# Altium project Relay Driver-10A-v1.0.PrjPcb (part 1 of 4)
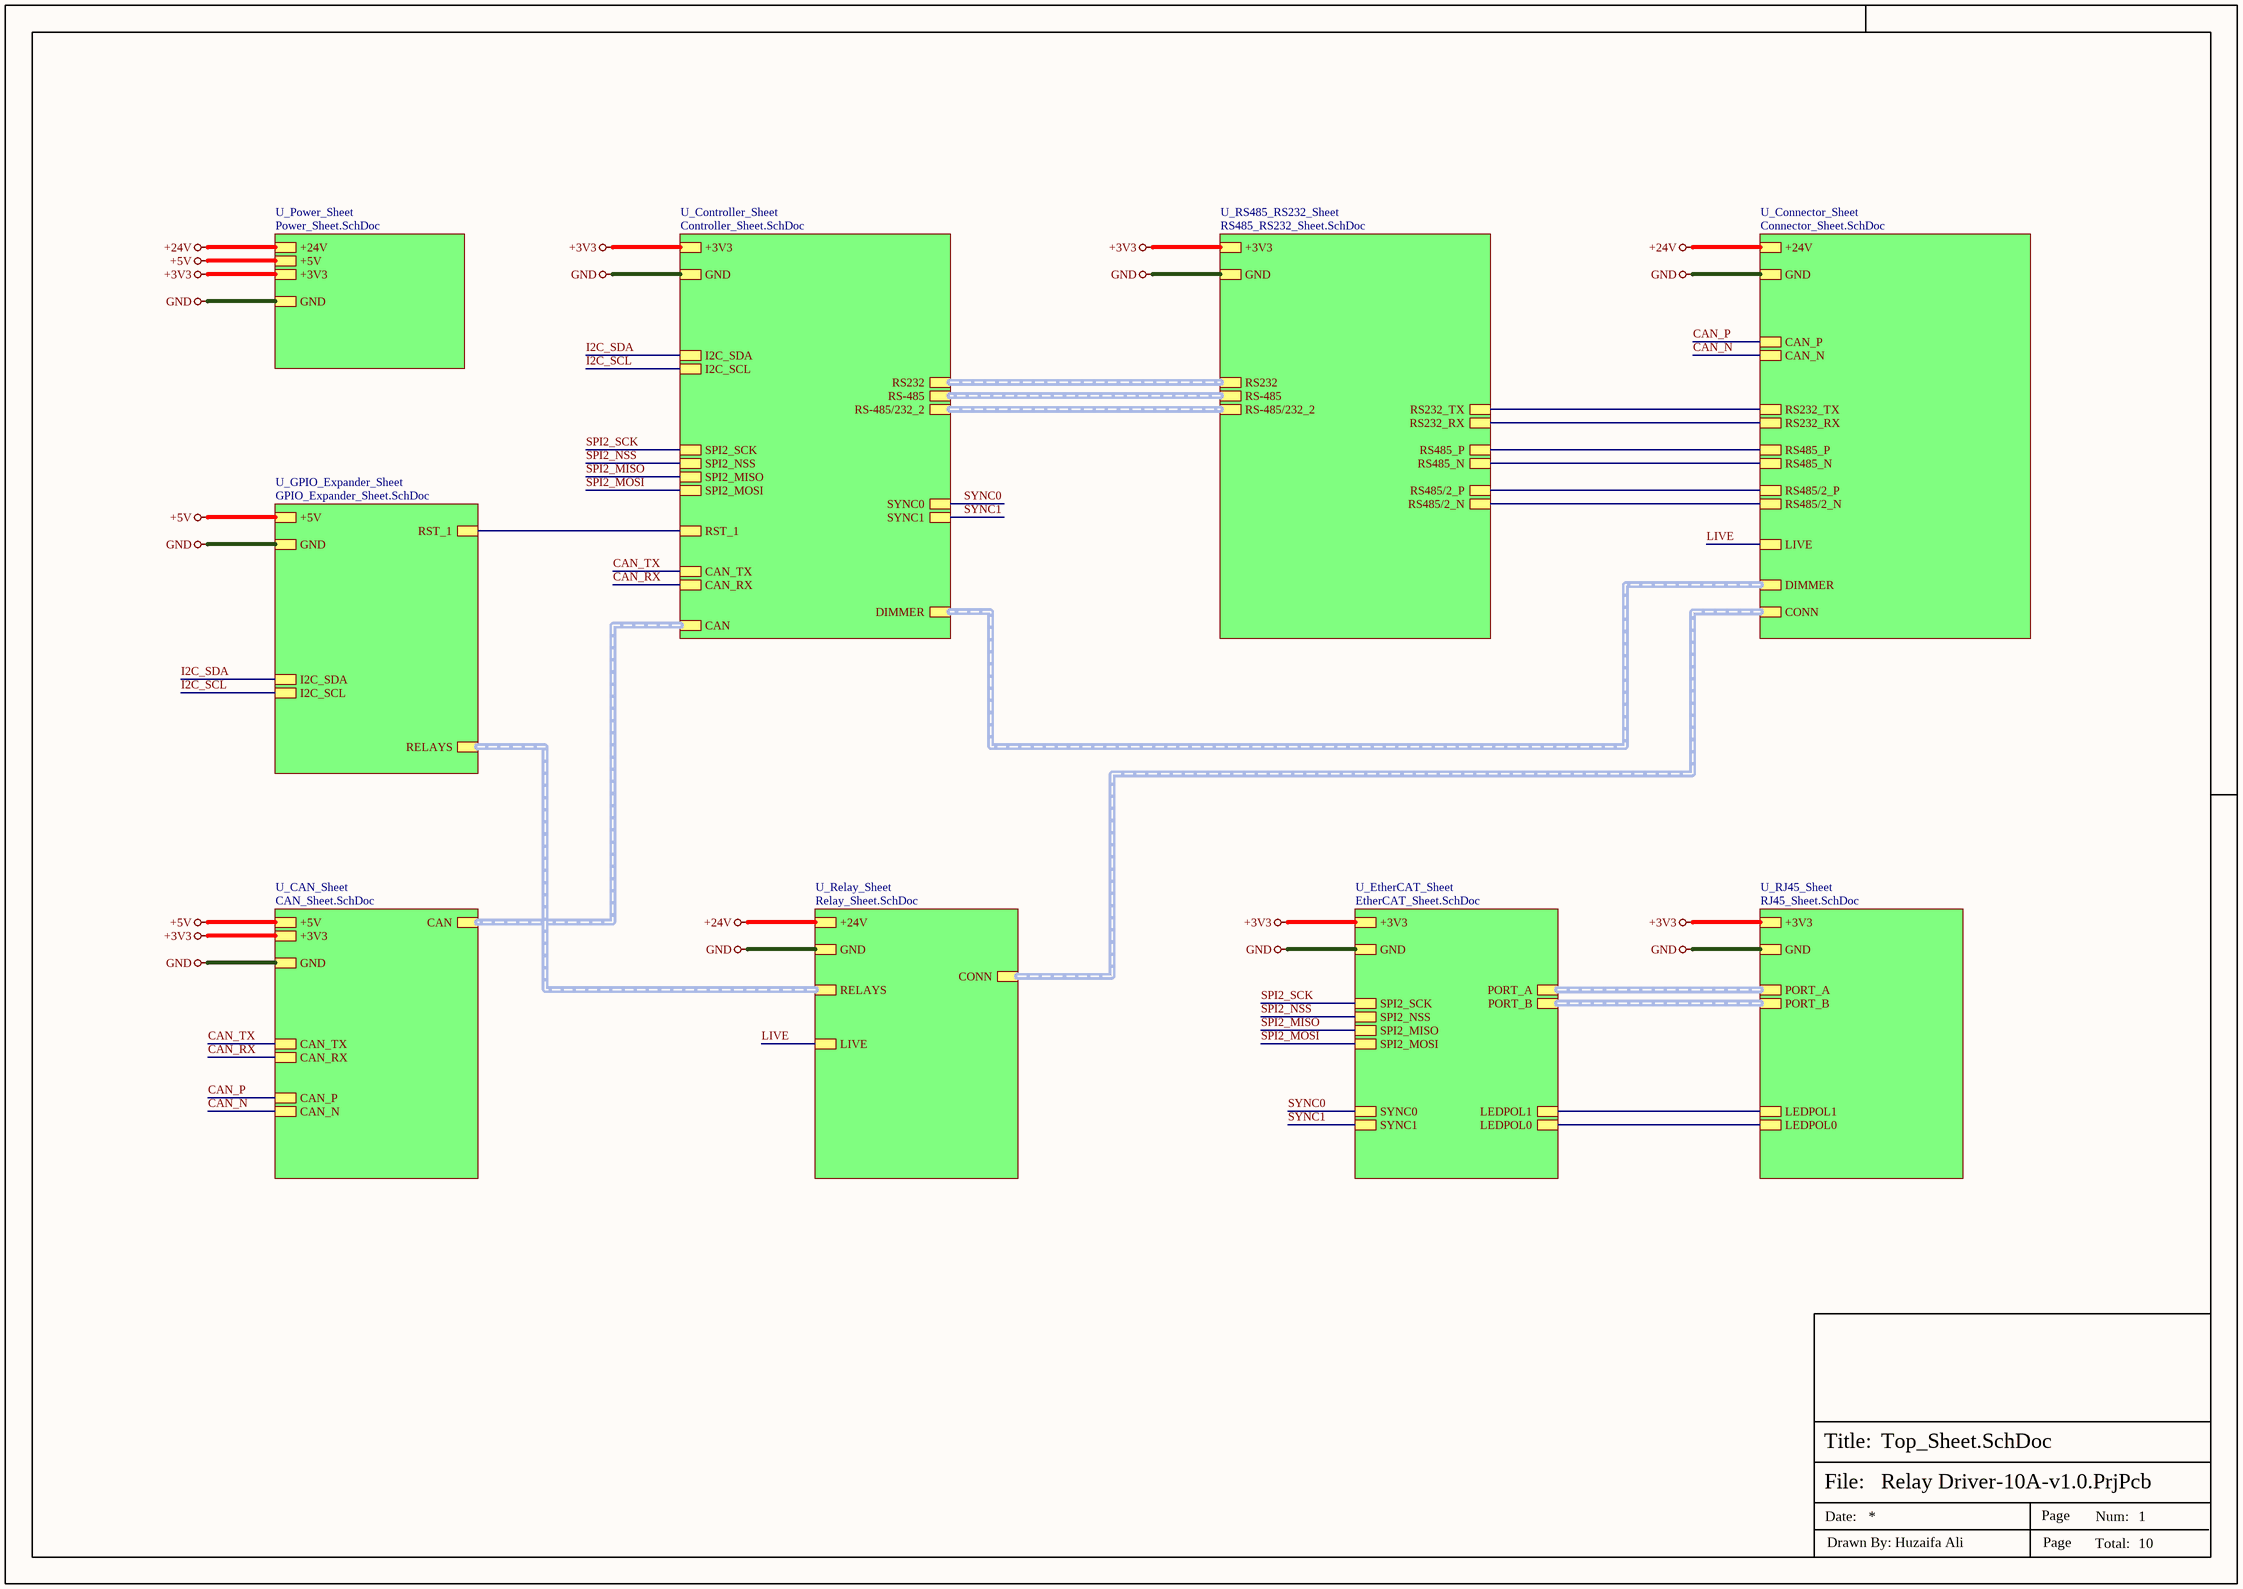
[diagram p0: Top_Sheet.SchDoc]
10 sheets, 284 parts. Net scope: hierarchical (ports join the sheet entries above them; power ports are global).
Board file: Relay-Driver10A.PcbDoc
Sheets:
  Top_Sheet.SchDoc
    U_CAN_Sheet = CAN_Sheet.SchDoc
    U_Connector_Sheet = Connector_Sheet.SchDoc
    U_Controller_Sheet = Controller_Sheet.SchDoc
    U_EtherCAT_Sheet = EtherCAT_Sheet.SchDoc
    U_Power_Sheet = Power_Sheet.SchDoc
    U_Relay_Sheet = Relay_Sheet.SchDoc
    U_RJ45_Sheet = RJ45_Sheet.SchDoc
    U_RS485_RS232_Sheet = RS485_RS232_Sheet.SchDoc
    U_GPIO_Expander_Sheet = GPIO_Expander_Sheet.SchDoc

## Sheet Top_Sheet.SchDoc
size 420 x 297 mm; SheetNumber: 1; SheetTotal: 10

### Sub-sheets
U_CAN_Sheet = CAN_Sheet.SchDoc: CAN (harness CAN), CAN_RX, CAN_TX, CAN_P, CAN_N, +5V, +3V3, GND
U_Connector_Sheet = Connector_Sheet.SchDoc: RS485/2_N, RS485/2_P, RS485_N, RS485_P, RS232_RX, RS232_TX, CAN_P, CAN_N, GND, +24V, CONN (harness CONN), LIVE, DIMMER (harness RELAYS)
U_Controller_Sheet = Controller_Sheet.SchDoc: SPI2_SCK, SPI2_NSS, SPI2_MISO, SPI2_MOSI, RS-485/232_2 (harness RS-485/232_2), RS232 (harness RS232), +3V3, GND, RS-485 (harness RS-485), CAN_RX, CAN_TX, CAN (harness CAN), SYNC0, SYNC1, RST_1, I2C_SDA, I2C_SCL, DIMMER (harness RELAYS)
U_EtherCAT_Sheet = EtherCAT_Sheet.SchDoc: PORT_A (harness PORT_A), PORT_B (harness PORT_B), LEDPOL0, LEDPOL1, SPI2_SCK, SPI2_NSS, SPI2_MISO, SPI2_MOSI, +3V3, GND, SYNC0, SYNC1
U_GPIO_Expander_Sheet = GPIO_Expander_Sheet.SchDoc: RST_1, RELAYS (harness RELAYS), +5V, GND, I2C_SDA, I2C_SCL
U_Power_Sheet = Power_Sheet.SchDoc: +5V, +3V3, GND, +24V
U_Relay_Sheet = Relay_Sheet.SchDoc: RELAYS (harness RELAYS), CONN (harness CONN), GND, +24V, LIVE
U_RJ45_Sheet = RJ45_Sheet.SchDoc: PORT_A (harness PORT_A), PORT_B (harness PORT_B), LEDPOL0, LEDPOL1, +3V3, GND
U_RS485_RS232_Sheet = RS485_RS232_Sheet.SchDoc: RS485_N, RS485_P, RS232_RX, RS232_TX, RS-485 (harness RS-485), +3V3, GND, RS485/2_N, RS485/2_P, RS-485/232_2 (harness RS-485/232_2), RS232 (harness RS232)

### Nets
+3V3: sheet U_CAN_Sheet/+3V3, sheet U_Controller_Sheet/+3V3, sheet U_EtherCAT_Sheet/+3V3, sheet U_Power_Sheet/+3V3, sheet U_RJ45_Sheet/+3V3, sheet U_RS485_RS232_Sheet/+3V3
+5V: sheet U_CAN_Sheet/+5V, sheet U_Power_Sheet/+5V, sheet U_GPIO_Expander_Sheet/+5V
+24V: sheet U_Connector_Sheet/+24V, sheet U_Power_Sheet/+24V, sheet U_Relay_Sheet/+24V
CAN_RX: sheet U_CAN_Sheet/CAN_RX, sheet U_Controller_Sheet/CAN_RX
CAN_TX: sheet U_CAN_Sheet/CAN_TX, sheet U_Controller_Sheet/CAN_TX
GND: sheet U_CAN_Sheet/GND, sheet U_Connector_Sheet/GND, sheet U_Controller_Sheet/GND, sheet U_EtherCAT_Sheet/GND, sheet U_Power_Sheet/GND, sheet U_Relay_Sheet/GND, sheet U_RJ45_Sheet/GND, sheet U_RS485_RS232_Sheet/GND, sheet U_GPIO_Expander_Sheet/GND
LIVE: sheet U_Connector_Sheet/LIVE, sheet U_Relay_Sheet/LIVE
RS232_RX: sheet U_Connector_Sheet/RS232_RX, sheet U_RS485_RS232_Sheet/RS232_RX
RS232_TX: sheet U_Connector_Sheet/RS232_TX, sheet U_RS485_RS232_Sheet/RS232_TX
CAN_N: sheet U_CAN_Sheet/CAN_N, sheet U_Connector_Sheet/CAN_N
CAN_P: sheet U_CAN_Sheet/CAN_P, sheet U_Connector_Sheet/CAN_P
I2C_SCL: sheet U_Controller_Sheet/I2C_SCL, sheet U_GPIO_Expander_Sheet/I2C_SCL
I2C_SDA: sheet U_Controller_Sheet/I2C_SDA, sheet U_GPIO_Expander_Sheet/I2C_SDA
LEDPOL0: sheet U_EtherCAT_Sheet/LEDPOL0, sheet U_RJ45_Sheet/LEDPOL0
LEDPOL1: sheet U_EtherCAT_Sheet/LEDPOL1, sheet U_RJ45_Sheet/LEDPOL1
RS485/2_N: sheet U_Connector_Sheet/RS485/2_N, sheet U_RS485_RS232_Sheet/RS485/2_N
RS485/2_P: sheet U_Connector_Sheet/RS485/2_P, sheet U_RS485_RS232_Sheet/RS485/2_P
RS485_N: sheet U_Connector_Sheet/RS485_N, sheet U_RS485_RS232_Sheet/RS485_N
RS485_P: sheet U_Connector_Sheet/RS485_P, sheet U_RS485_RS232_Sheet/RS485_P
RST_1: sheet U_Controller_Sheet/RST_1, sheet U_GPIO_Expander_Sheet/RST_1
SPI2_MISO: sheet U_Controller_Sheet/SPI2_MISO, sheet U_EtherCAT_Sheet/SPI2_MISO
SPI2_MOSI: sheet U_Controller_Sheet/SPI2_MOSI, sheet U_EtherCAT_Sheet/SPI2_MOSI
SPI2_NSS: sheet U_Controller_Sheet/SPI2_NSS, sheet U_EtherCAT_Sheet/SPI2_NSS
SPI2_SCK: sheet U_Controller_Sheet/SPI2_SCK, sheet U_EtherCAT_Sheet/SPI2_SCK
SYNC0: sheet U_Controller_Sheet/SYNC0, sheet U_EtherCAT_Sheet/SYNC0
SYNC1: sheet U_Controller_Sheet/SYNC1, sheet U_EtherCAT_Sheet/SYNC1

### Buses and harness runs
harness sheet U_CAN_Sheet/CAN = sheet U_Controller_Sheet/CAN
harness sheet U_Connector_Sheet/CONN = sheet U_Relay_Sheet/CONN
harness sheet U_Connector_Sheet/DIMMER = sheet U_Controller_Sheet/DIMMER
harness sheet U_Controller_Sheet/RS232 = sheet U_RS485_RS232_Sheet/RS232
harness sheet U_Controller_Sheet/RS-485 = sheet U_RS485_RS232_Sheet/RS-485
harness sheet U_Controller_Sheet/RS-485/232_2 = sheet U_RS485_RS232_Sheet/RS-485/232_2
harness sheet U_EtherCAT_Sheet/PORT_A = sheet U_RJ45_Sheet/PORT_A
harness sheet U_EtherCAT_Sheet/PORT_B = sheet U_RJ45_Sheet/PORT_B
harness sheet U_GPIO_Expander_Sheet/RELAYS = sheet U_Relay_Sheet/RELAYS

### Notes on the sheet
- File:
- Title:
- Date:
- Page
- Num:
- Total:
- Drawn By: Huzaifa Ali

## Sheet CAN_Sheet.SchDoc
size 420 x 297 mm; SheetNumber: 4; SheetTotal: 10
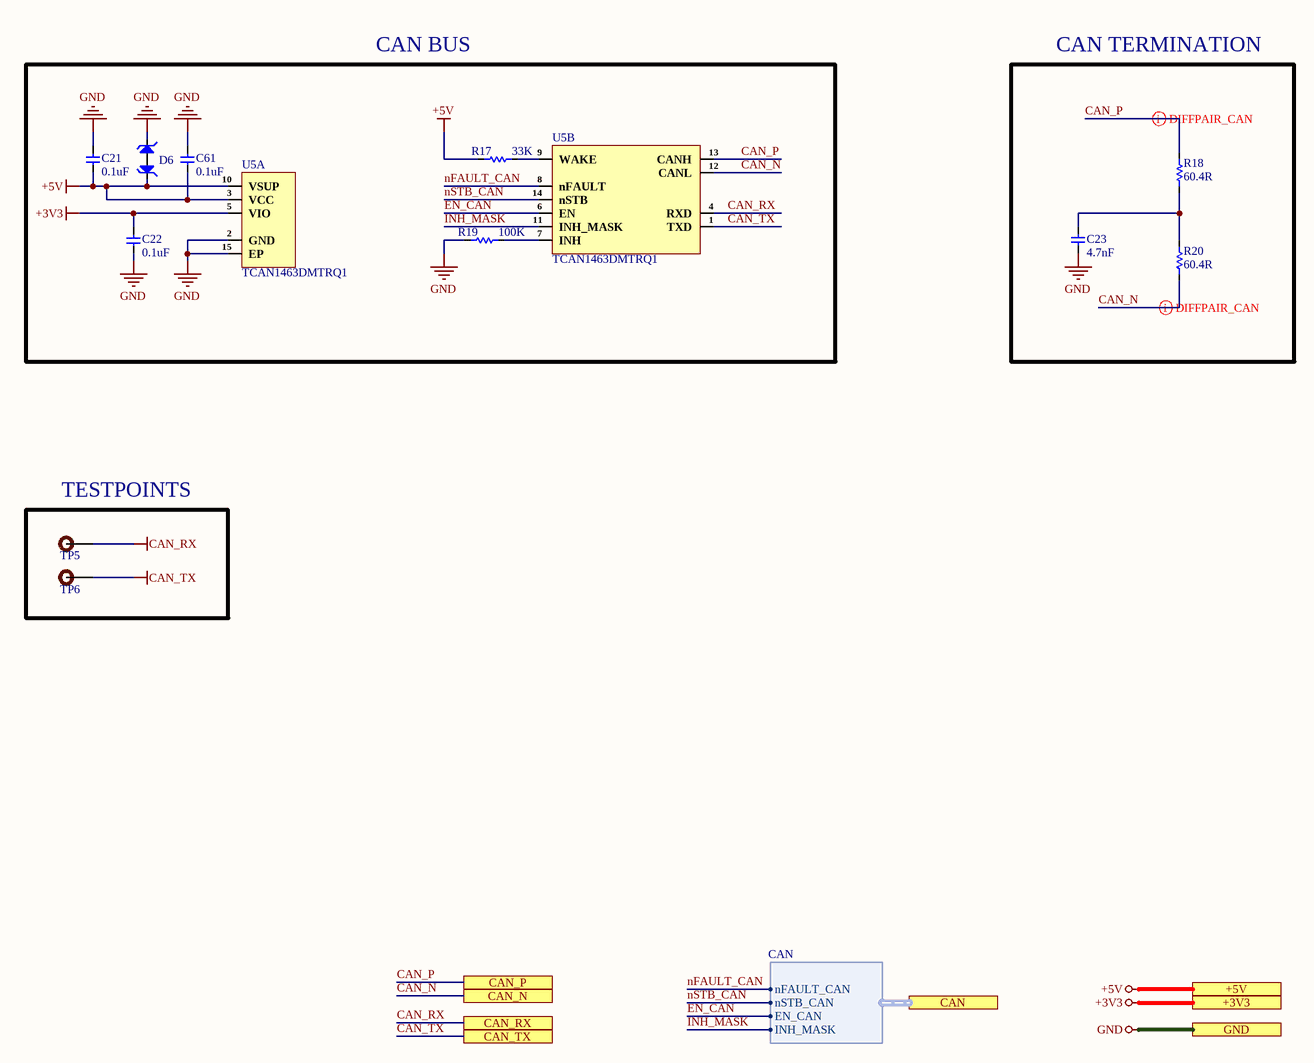
[diagram p1: CAN_Sheet.SchDoc]

### Parts
C21  0.1uF  [Cap-0402]
C22  0.1uF  [Cap-0402]
C23  4.7nF  [Cap-0402]
C61  0.1uF  [Cap-0402]
D6  PESD5V0H1BSFYL  [DSN0603-2]  (value not drawn)
R17  33K  [Res-0402]
R18  60.4R  [Res-0603]
R19  100K  [Res-0402]
R20  60.4R  [Res-0603]
TP5  TEST POINT  [Test-point]  (value not drawn)  (no BOM)
TP6  TEST POINT  [Test-point]  (value not drawn)  (no BOM)
U5  TCAN1463DMTRQ1  [VSON-14(3x4.5)]  (parts A,B of 2)

### Ports
+3V3 (see Top_Sheet[1C], Controller_Sheet[5D], EtherCAT_Sheet[5D], Power_Sheet[5D], RJ45_Sheet[5D], RS485_RS232_Sheet[5D]), +5V (see Top_Sheet[1C], GPIO_Expander_Sheet[5D], Power_Sheet[5D]), CAN (harness CAN, see Top_Sheet[2C], Controller_Sheet[2D]), CAN_N (see Top_Sheet[1C], Connector_Sheet[4D]), CAN_P (see Top_Sheet[1C], Connector_Sheet[4D]), CAN_RX (see Top_Sheet[1C], Controller_Sheet[1D]), CAN_TX (see Top_Sheet[1C], Controller_Sheet[1D]), GND (see Top_Sheet[1C], Connector_Sheet[5D], Controller_Sheet[5D], EtherCAT_Sheet[5D], GPIO_Expander_Sheet[5D], Power_Sheet[5D], Relay_Sheet[5D], RJ45_Sheet[5D], RS485_RS232_Sheet[5D])

### Harnesses
CAN: nFAULT_CAN, nSTB_CAN, EN_CAN, INH_MASK

### Nets
+3V3: C22.2 U5.5(VIO) ; port +3V3
+5V: C21.1 C61.1 D6.1 R17.1 U5.3(VCC) U5.10(VSUP) ; port +5V
CAN_RX: TP5.1 U5.4(RXD) ; port CAN_RX
CAN_TX: TP6.1 U5.1(TXD) ; port CAN_TX
GND: C21.2 C22.1 C23.2 C61.2 D6.2 R19.1 U5.2(GND) U5.15(EP) ; port GND
CAN_N: R20.2 U5.12(CANL) ; port CAN_N
CAN_P: R18.1 U5.13(CANH) ; port CAN_P
EN_CAN: U5.6(EN) ; port CAN.EN_CAN
INH_MASK: U5.11(INH_MASK) ; port CAN.INH_MASK
nFAULT_CAN: U5.8(nFAULT) ; port CAN.nFAULT_CAN
nSTB_CAN: U5.14(nSTB) ; port CAN.nSTB_CAN
NetC23_1: C23.1 R18.2 R20.1
NetR17_2: R17.2 U5.9(WAKE)
NetR19_2: R19.2 U5.7(INH)

### Layout directives
differential pair; net class CAN; differential pair class CAN_Lines: CAN_N, CAN_P

### Notes on the sheet
- CAN BUS
- CAN TERMINATION
- (near TP5) TESTPOINTS
- File:
- Title:
- Date:
- Page
- Num:
- Total:
- Drawn By: Huzaifa Ali

### Library data of the parts
C21 C22 C61 = CC0402JRX7R7BB104: CAP CER 0.1UF 16V X7R 0402; Manufacturer: Yageo; Material: 4241ConductorMaterial; Value: 100nF; Tolerance: 5%; Item Type: Capacitor; Supplier: Digikey; Supplier Part Number: 311-1676-1-ND; Manufacturer Part Number: CC0402JRX7R7BB104; RoHS: Yes; Category: Ceramic Capacitors; Stock: 1659111; Pricing: 1=0.1, 10=0.046, 50=0.0262, 100=0.0203, 500=0.01528, 1000=0.012, 2500=0.01091, 5000=0.01004 (USD); Mounting Technology: Surface Mount; Case/Package: 0402; Case Code (Metric): 1005; Case Code (Imperial): 0402; Min Operating Temperature: -55°C; Max Operating Temperature: 125°C; Dielectric: X7R; Packaging: Tape and Reel; Package Quantity: 10000; Voltage Rating (DC): 16V; Voltage Rating: 16V; Series: CC; Construction: Flat; Length: 0.039inch; Width: 0.02inch; Height: 0.5mm; Thickness: 0.022inch; Lead Free: Lead Free; Halogen Free: Halogen Free; RoHS Compliant: Yes; ComponentLink1URL: https://datasheet.ciiva.com/13210/upy-gphc-x7r-6-3v-to-50v-8-12304-13210152.pdf?src-supplier=Mouser; ComponentLink1Description: https://datasheet.ciiva.com/13210/upy-gphc-x7r-6-3v-to-50v-8-12304-13210152.pdf?src-supplier=Mouser; LCSC Part Number: C541464
C23 = CC0402KRX7R9BB472: CAP CER 4700PF 50V X7R 0402; Manufacturer: Yageo; Material: 4241ConductorMaterial; Tolerance: 10%; Temperature Coefficient: 30ppm/°C; Item Type: Capacitor; Supplier 1: Future Electronics; Manufacturer Part Number: CC0402KRX7R9BB472; RoHS: Yes; Category: Ceramic Capacitors; Stock 1: 1780000; Pricing 1: 10000=0.0021, 40000=0.002, 150000=0.0019, 400000=0.0018, 1000000=0.0017 (USD); Mount: Surface Mount; Case/Package: 0402; Number of Pins: 2NUMBER; Case Code (Imperial): 0402; Case Code (Metric): 1005; Min Operating Temperature: -55°C; Max Operating Temperature: 125°C; Capacitance: 4.7nF; Dielectric: X7R; Voltage Rating: 50V; Voltage Rating (DC): 50V; Packaging: Tape and Reel; Package Quantity: 1; Termination: SMD/SMT; Series: CC; Construction: Flat; Length: 1mm; Width: 0.02inch; Height: 0.5mm; Thickness: 0.022inch; Depth: 0.5mm; Radiation Hardening: No; Reach SVHC Compliant: No; RoHS Compliant: Yes; Halogen Free: 5694HalogenFree; Lead Free: 5697LeadFree; ComponentLink1URL: https://datasheet.ciiva.com/7978/1489800-7978108.pdf?src-supplier=Element14; ComponentLink1Description: https://datasheet.ciiva.com/7978/1489800-7978108.pdf?src-supplier=Element14; ComponentLink2URL: https://datasheet.ciiva.com/176/mlccorderingcode-176364.pdf?src-supplier=Digikey; ComponentLink2Description: https://datasheet.ciiva.com/176/mlccorderingcode-176364.pdf?src-supplier=Digikey; ComponentLink3URL: https://datasheet.ciiva.com/176/mlccorderingcode-176363.pdf?src-supplier=Digikey; ComponentLink3Description: https://datasheet.ciiva.com/176/mlccorderingcode-176363.pdf?src-supplier=Digikey; ComponentLink4URL: https://datasheet.ciiva.com/176/mlccorderingcode-176365.pdf?src-supplier=Digikey; ComponentLink4Description: https://datasheet.ciiva.com/176/mlccorderingcode-176365.pdf?src-supplier=Digikey; ComponentLink5URL: https://datasheet.ciiva.com/11586/upy-gphc-x7r-6-3v-to-50v-8-11586491.pdf?src-supplier=Avnet; ComponentLink5Description: https://datasheet.ciiva.com/11586/upy-gphc-x7r-6-3v-to-50v-8-11586491.pdf?src-supplier=Avnet; Supplier Part Number 1: 1989300
D6 = PESD5V0H1BSFYL: TVS DIODE 5VWM 6.3VC DSN0603-2; Manufacturer: Nexperia; Supplier 1: Avnet; Manufacturer Part Number: PESD5V0H1BSFYL; RoHS: Yes; Category: ESD and Circuit Protection ICs; Stock 1: 9000; Pricing 1: 18000=0.06453, 36000=0.06278, 54000=0.06104, 90000=0.05930, 180000=0.05755, 900000=0.05581, 1800000=0.05406 (USD); RoHS Compliant: Yes; ComponentLink1URL: http://www.farnell.com/datasheets/1961312.pdf?src-supplier=Farnell; ComponentLink1Description: http://www.farnell.com/datasheets/1961312.pdf?src-supplier=Farnell; ComponentLink2URL: https://assets.nexperia.com/documents/data-sheet/PESD5V0H1BSF.pdf?src-supplier=Digi-Key; ComponentLink2Description: https://assets.nexperia.com/documents/data-sheet/PESD5V0H1BSF.pdf?src-supplier=Digi-Key; ComponentLink3URL: http://www.farnell.com/datasheets/1961312.pdf?src-supplier=Newark; ComponentLink3Description: http://www.farnell.com/datasheets/1961312.pdf?src-supplier=Newark; Supplier Part Number 1: PESD5V0H1BSFYL; LCSC Part Number: C477989; Item Type: Diode
R17 = RC0402FR-0733KL: RES 33K OHM 1% 1/16W 0402; Manufacturer: YAGEO; Item Type: Resistor; Manufacturer Part Number: RC0402FR-0733KL; Package: 0402; LCSC Part Number: C138003; ComponentLink1Description: LCSC; ComponentLink1URL: https://www.lcsc.com/product-detail/Chip-Resistor-Surface-Mount_YAGEO-RC0402FR-0733KL_C138003.html
R18 R20 = RTT0360R4FTP: 100mW Thick Film Resistors ±100ppm/℃ ±1% 60.4Ω 0603 Chip Resistor - Surface Mount ROHS; Manuacturer: RALEC; Manufacturer Part Number: RTT0360R4FTP; Package: 0603; Value: 60.4R; LCSC Part Number: C103744; ComponentLink1Description: LCSC; ComponentLink1URL: https://www.lcsc.com/product-detail/Chip-Resistor-Surface-Mount_RALEC-RTT0360R4FTP_C103744.html
R19 = RC0402FR-07100KL: RES 100K OHM 1% 1/16W 0402; Manufacturer: Yageo; Resistance: 100kR; Temperature Coefficient: 100ppm/°C; Power Rating: 63mW; Voltage Rating: 50V; Item Type: Resistor; Supplier 1: Mouser; Manufacturer Part Number: RC0402FR-07100KL; RoHS: Yes; Category: Chip SMD Resistors; Stock 1: 7759549; Pricing 1: 1=0.10000, 10=0.01200, 50=0.01200, 100=0.00500, 1000=0.00300, 2500=0.00200, 10000=0.00100 (USD); Case/Package: 0402; Case Code (Metric): 1005; Case Code (Imperial): 0402; Min Operating Temperature: -55°C; Max Operating Temperature: 155°C; Resistor Type: Thick Film; Tolerance: 1%; Packaging: Tape and Reel; Package Quantity: 1; Number of Terminations: 2; Termination: SMD/SMT; Max Power Dissipation: 63mW; Working Voltage: 50V; Features: Moisture Resistant; Series: RC; Resistance Tolerance: 1%; Construction: Rectangular; Technology: THICK FILM; Length: 0.039inch; Width: 0.02inch; Height: 0.016inch; Depth: 0.5mm; REACH SVHC: No SVHC; Lead Free: Lead Free; RoHS Compliant: Yes; Military Standard: Not; ComponentLink1URL: https://datasheet.ciiva.com/11819/0900766b80c66297-11819452.pdf?src-supplier=RSComponents; ComponentLink1Description: https://datasheet.ciiva.com/11819/0900766b80c66297-11819452.pdf?src-supplier=RSComponents; ComponentLink2URL: https://datasheet.ciiva.com/22747/1018594-22747509.pdf?src-supplier=Element14; ComponentLink2Description: https://datasheet.ciiva.com/22747/1018594-22747509.pdf?src-supplier=Element14; ComponentLink3URL: https://datasheet.ciiva.com/2453/pyu-r-int-thick-7-2453362.pdf?src-supplier=Digi-Key; ComponentLink3Description: https://datasheet.ciiva.com/2453/pyu-r-int-thick-7-2453362.pdf?src-supplier=Digi-Key; ComponentLink4URL: https://datasheet.ciiva.com/2453/pyu-r-int-thick-7-2453363.pdf?src-supplier=Digi-Key; ComponentLink4Description: https://datasheet.ciiva.com/2453/pyu-r-int-thick-7-2453363.pdf?src-supplier=Digi-Key; ComponentLink5URL: https://datasheet.ciiva.com/2453/pyu-r-int-thick-7-2453361.pdf?src-supplier=Digi-Key; ComponentLink5Description: https://datasheet.ciiva.com/2453/pyu-r-int-thick-7-2453361.pdf?src-supplier=Digi-Key; ComponentLink6URL: https://datasheet.ciiva.com/12667/pyu-rc0402-51-rohs-l-6-r-12667930.pdf?src-supplier=Mouser; ComponentLink6Description: https://datasheet.ciiva.com/12667/pyu-rc0402-51-rohs-l-6-r-12667930.pdf?src-supplier=Mouser; ComponentLink7URL: https://datasheet.ciiva.com/15189/getdatasheetpartid-323696-15189334.pdf?src-supplier=Verical; ComponentLink7Description: https://datasheet.ciiva.com/15189/getdatasheetpartid-323696-15189334.pdf?src-supplier=Verical; Supplier Part Number 1: 603-RC0402FR-07100KL; LCSC Part Number: C60491
TP5 TP6 = TEST POINT: Test Point ON; Item Type: TEST POINT
U5 = TCAN1463DMTRQ1: IC TRANSCEIVER HALF 1/1 14VSON; Manufacturer: Texas Instruments; Supplier: Mouser; Supplier Part Number: 595-TCAN1463DMTRQ1; Manufacturer Part Number: TCAN1463DMTRQ1; RoHS: Yes; Item Type: IC; Stock: 20610; Pricing: 1=2.47, 10=2.22, 50=2.22, 100=1.78, 1000=1.21, 10000=1.09 (USD); LCSC Part Number: C5215823

## Sheet Connector_Sheet.SchDoc
size 420 x 297 mm; SheetNumber: 10; SheetTotal: 10
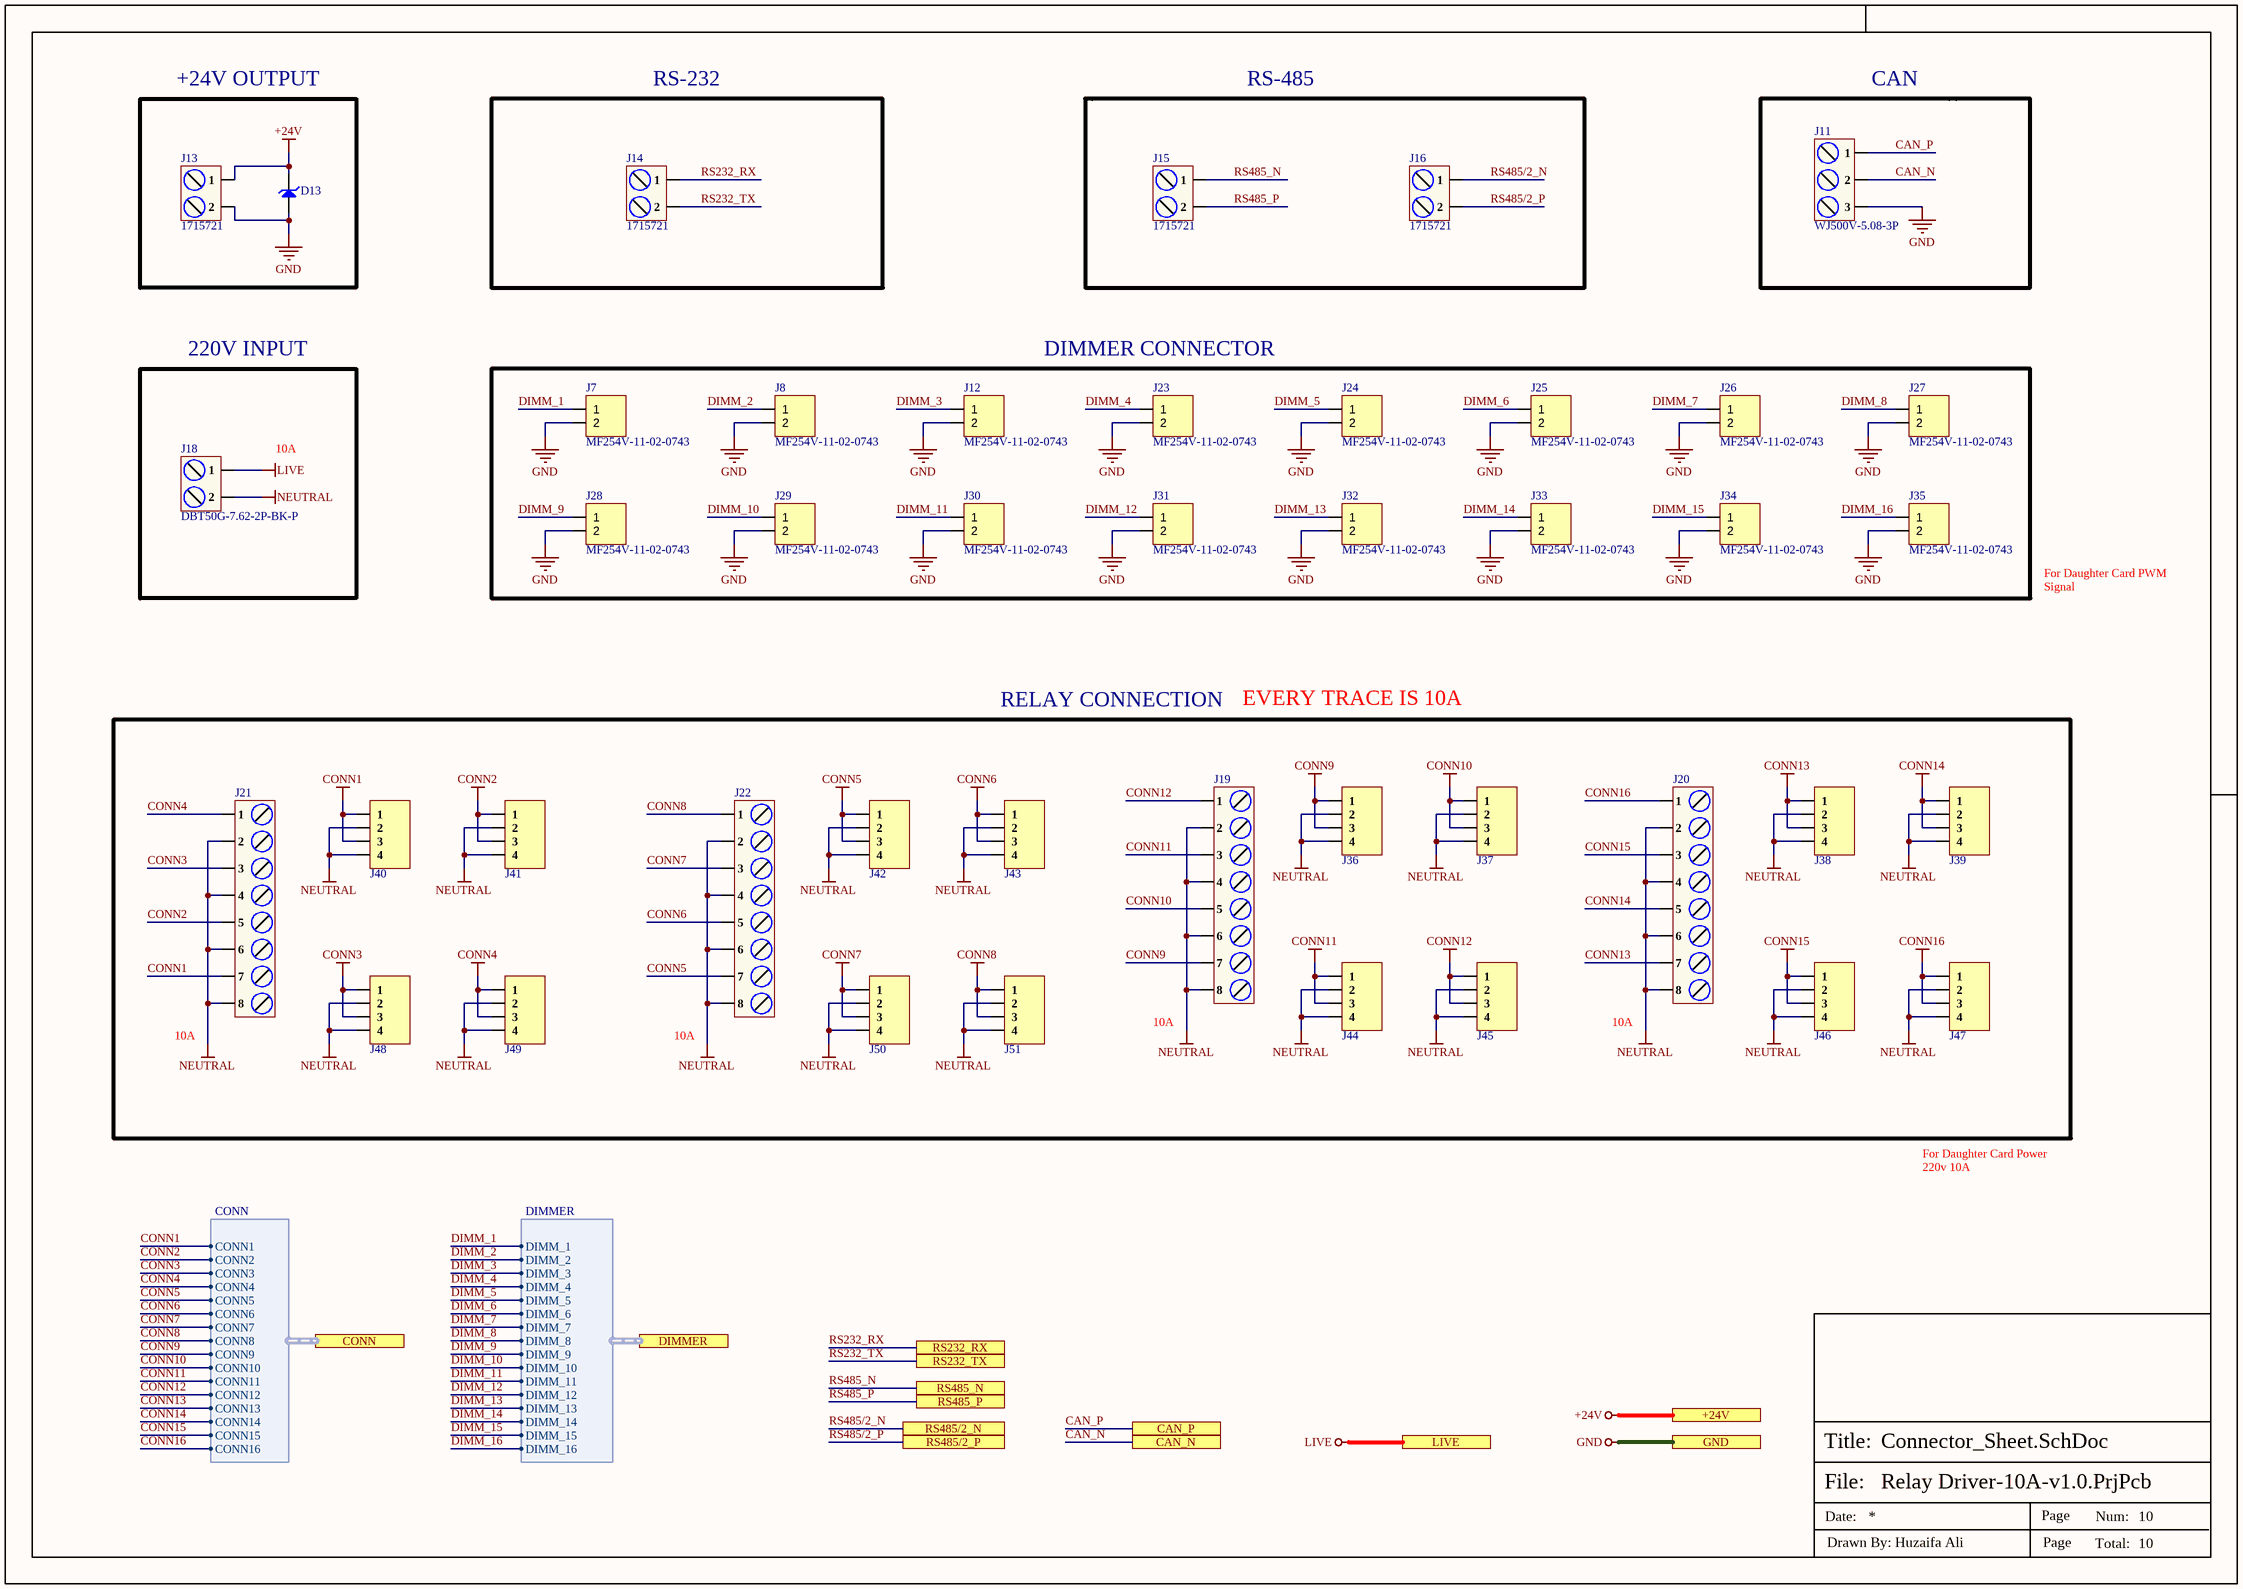
[diagram p2: Connector_Sheet.SchDoc]

### Parts
D13  SMBJ28A-13-F  [SMB_]  (value not drawn)
J7  MF254V-11-02-0743  [MF254V-11-02-0743]
J8  MF254V-11-02-0743  [MF254V-11-02-0743]
J11  WJ500V-5.08-3P  [WJ500V-5.08-3P]
J12  MF254V-11-02-0743  [MF254V-11-02-0743]
J13  1715721  [1715721]
J14  1715721  [1715721]
J15  1715721  [1715721]
J16  1715721  [1715721]
J18  DBT50G-7.62-2P-BK-P  [DBT50G-7.62-2P-BK-P]
J19  DBT50G-7.62-8P-BK-P  [DBT50G-7.62-8P-BK-P]  (value not drawn)
J20  DBT50G-7.62-8P-BK-P  [DBT50G-7.62-8P-BK-P]  (value not drawn)
J21  DBT50G-7.62-8P-BK-P  [DBT50G-7.62-8P-BK-P]  (value not drawn)
J22  DBT50G-7.62-8P-BK-P  [DBT50G-7.62-8P-BK-P]  (value not drawn)
J23  MF254V-11-02-0743  [MF254V-11-02-0743]
J24  MF254V-11-02-0743  [MF254V-11-02-0743]
J25  MF254V-11-02-0743  [MF254V-11-02-0743]
J26  MF254V-11-02-0743  [MF254V-11-02-0743]
J27  MF254V-11-02-0743  [MF254V-11-02-0743]
J28  MF254V-11-02-0743  [MF254V-11-02-0743]
J29  MF254V-11-02-0743  [MF254V-11-02-0743]
J30  MF254V-11-02-0743  [MF254V-11-02-0743]
J31  MF254V-11-02-0743  [MF254V-11-02-0743]
J32  MF254V-11-02-0743  [MF254V-11-02-0743]
J33  MF254V-11-02-0743  [MF254V-11-02-0743]
J34  MF254V-11-02-0743  [MF254V-11-02-0743]
J35  MF254V-11-02-0743  [MF254V-11-02-0743]
J36  0447690401  (value not drawn)
J37  0447690401  (value not drawn)
J38  0447690401  (value not drawn)
J39  0447690401  (value not drawn)
J40  0447690401  (value not drawn)
J41  0447690401  (value not drawn)
J42  0447690401  (value not drawn)
J43  0447690401  (value not drawn)
J44  0447690401  (value not drawn)
J45  0447690401  (value not drawn)
J46  0447690401  (value not drawn)
J47  0447690401  (value not drawn)
J48  0447690401  (value not drawn)
J49  0447690401  (value not drawn)
J50  0447690401  (value not drawn)
J51  0447690401  (value not drawn)

### Blocks framed on the sheet
10A: J18
EVERY TRACE IS 10A: J19-J22 J36-J51

### Ports
+24V (see Top_Sheet[5A], Power_Sheet[5D], Relay_Sheet[5D]), CAN_N (see Top_Sheet[5A], CAN_Sheet[3D]), CAN_P (see Top_Sheet[5A], CAN_Sheet[3D]), CONN (harness CONN, see Top_Sheet[5B], Relay_Sheet[2D]), DIMMER (harness DIMMER, see Top_Sheet[5B], Controller_Sheet[6C]), GND (see Top_Sheet[5A], CAN_Sheet[5D], Controller_Sheet[5D], EtherCAT_Sheet[5D], GPIO_Expander_Sheet[5D], Power_Sheet[5D], Relay_Sheet[5D], RJ45_Sheet[5D], RS485_RS232_Sheet[5D]), LIVE (see Top_Sheet[5B], Relay_Sheet[4D]), RS232_RX (see Top_Sheet[5B], RS485_RS232_Sheet[2D]), RS232_TX (see Top_Sheet[5B], RS485_RS232_Sheet[2D]), RS485/2_N (see Top_Sheet[5B], RS485_RS232_Sheet[1D]), RS485/2_P (see Top_Sheet[5B], RS485_RS232_Sheet[1D]), RS485_N (see Top_Sheet[5B], RS485_RS232_Sheet[1D]), RS485_P (see Top_Sheet[5B], RS485_RS232_Sheet[1D])

### Harnesses
CONN: CONN1, CONN2, CONN3, CONN4, CONN5, CONN6, CONN7, CONN8, CONN9, CONN10, CONN11, CONN12, CONN13, CONN14, CONN15, CONN16
DIMMER: DIMM_1, DIMM_2, DIMM_3, DIMM_4, DIMM_5, DIMM_6, DIMM_7, DIMM_8, DIMM_9, DIMM_10, DIMM_11, DIMM_12, DIMM_13, DIMM_14, DIMM_15, DIMM_16

### Nets
+24V: D13.2(K) J13.1 ; port +24V
CONN1: J21.7 J40.1 J40.3 ; port CONN.CONN1
CONN2: J21.5 J41.1 J41.3 ; port CONN.CONN2
CONN3: J21.3 J48.1 J48.3 ; port CONN.CONN3
CONN4: J21.1 J49.1 J49.3 ; port CONN.CONN4
CONN5: J22.7 J42.1 J42.3 ; port CONN.CONN5
CONN6: J22.5 J43.1 J43.3 ; port CONN.CONN6
CONN7: J22.3 J50.1 J50.3 ; port CONN.CONN7
CONN8: J22.1 J51.1 J51.3 ; port CONN.CONN8
CONN9: J19.7 J36.1 J36.3 ; port CONN.CONN9
CONN10: J19.5 J37.1 J37.3 ; port CONN.CONN10
CONN11: J19.3 J44.1 J44.3 ; port CONN.CONN11
CONN12: J19.1 J45.1 J45.3 ; port CONN.CONN12
CONN13: J20.7 J38.1 J38.3 ; port CONN.CONN13
CONN14: J20.5 J39.1 J39.3 ; port CONN.CONN14
CONN15: J20.3 J46.1 J46.3 ; port CONN.CONN15
CONN16: J20.1 J47.1 J47.3 ; port CONN.CONN16
GND: D13.1(A) J7.2 J8.2 J11.3 J12.2 J13.2 J23.2 J24.2 J25.2 J26.2 J27.2 J28.2 J29.2 J30.2 J31.2 J32.2 J33.2 J34.2 J35.2 ; port GND
LIVE: J18.1 ; port LIVE
NEUTRAL: J18.2 J19.2 J19.4 J19.6 J19.8 J20.2 J20.4 J20.6 J20.8 J21.2 J21.4 J21.6 J21.8 J22.2 J22.4 J22.6 J22.8 J36.2 J36.4 J37.2 J37.4 J38.2 J38.4 J39.2 J39.4 J40.2 J40.4 J41.2 J41.4 J42.2 J42.4 J43.2 J43.4 J44.2 J44.4 J45.2 J45.4 J46.2 J46.4 J47.2 J47.4 J48.2 J48.4 J49.2 J49.4 J50.2 J50.4 J51.2 J51.4
RS232_RX: J14.1 ; port RS232_RX
RS232_TX: J14.2 ; port RS232_TX
CAN_N: J11.2 ; port CAN_N
CAN_P: J11.1 ; port CAN_P
DIMM_1: J7.1 ; port DIMMER.DIMM_1
DIMM_2: J8.1 ; port DIMMER.DIMM_2
DIMM_3: J12.1 ; port DIMMER.DIMM_3
DIMM_4: J23.1 ; port DIMMER.DIMM_4
DIMM_5: J24.1 ; port DIMMER.DIMM_5
DIMM_6: J25.1 ; port DIMMER.DIMM_6
DIMM_7: J26.1 ; port DIMMER.DIMM_7
DIMM_8: J27.1 ; port DIMMER.DIMM_8
DIMM_9: J28.1 ; port DIMMER.DIMM_9
DIMM_10: J29.1 ; port DIMMER.DIMM_10
DIMM_11: J30.1 ; port DIMMER.DIMM_11
DIMM_12: J31.1 ; port DIMMER.DIMM_12
DIMM_13: J32.1 ; port DIMMER.DIMM_13
DIMM_14: J33.1 ; port DIMMER.DIMM_14
DIMM_15: J34.1 ; port DIMMER.DIMM_15
DIMM_16: J35.1 ; port DIMMER.DIMM_16
RS485/2_N: J16.1 ; port RS485/2_N
RS485/2_P: J16.2 ; port RS485/2_P
RS485_N: J15.1 ; port RS485_N
RS485_P: J15.2 ; port RS485_P

### Notes on the sheet
- +24V OUTPUT
- RS-232
- RS-485
- CAN
- 220V INPUT
- (near J23) DIMMER CONNECTOR
- For Daughter Card PWM Signal
- RELAY CONNECTION
- (near J21) 10A
- (near J22) 10A
- (near J19) 10A
- (near J20) 10A
- For Daughter Card Power 220v 10A
- File:
- Title:
- Date:
- Page
- Num:
- Total:
- Drawn By: Huzaifa Ali

### Library data of the parts
D13 = SMBJ28A-13-F: TVS DIODE 28VWM 45.4VC SMB; Manufacturer: Diodes; Test Current: 1mA; Number of Elements: 1; Power Dissipation: 600W; Forward Voltage: 5V; Direction: Unidirectional; Reverse Breakdown Voltage: 31.1V; Max Surge Current: 13.2A; Reverse Standoff Voltage: 28V; Clamping Voltage: 45.4V; Power Line Protection: No; Breakdown Voltage: 35.8V; Max Reverse Leakage Current: 5uA; Value: 330pF; Diode Type: ZENER; Supplier: Future Electronics; Supplier Part Number: 8797342; Manufacturer Part Number: SMBJ28A-13-F; RoHS: Yes; Category: TVS Diodes; Stock: 39000; Pricing: 3000=0.0734, 9000=0.0706, 15000=0.0693, 30000=0.0676, 60000=0.065 (USD); Mounting Technology: Surface Mount; Case/Package: SMB; Pins: 2; Min Operating Temperature: -55°C; Max Operating Temperature: 150°C; Packaging: Tape and Reel; Package Quantity: 3000; Max Power Dissipation: 600W; Series: SMBJ; Number of Unidirectional Channels: 1; Min Breakdown Voltage: 31.1V; Peak Pulse Power: 600W; Polarity: Unidirectional; Termination: SMD/SMT; Peak Pulse Current: 13.2A; Max Breakdown Voltage: 35.8V; Leakage Current: 5uA; Working Voltage: 28V; Voltage Rating (DC): 28V; Max Output current: 13.2A; Clamping Voltage-Max: 45.4V; Length: 4.57mm; Width: 3.9mm; Height: 2.62mm; Radiation Hardening: No; RoHS Compliant: Yes; Lead Free: Lead Free; ComponentLink1URL: https://datasheet.ciiva.com/16387/ds19002-16387564.pdf?src-supplier=Future+Electronics; ComponentLink1Description: https://datasheet.ciiva.com/16387/ds19002-16387564.pdf?src-supplier=Future+Electronics; ComponentLink2URL: https://datasheet.ciiva.com/26912/getdatasheetpartid-234000-26912533.pdf?src-supplier=Verical; ComponentLink2Description: https://datasheet.ciiva.com/26912/getdatasheetpartid-234000-26912533.pdf?src-supplier=Verical; Item Type: Diode
J7 J8 J12 J23-J35 = MF254V-11-02-0743: 2.54mm Single Row 3A 2P -40℃~+105℃ Direct Insert 1x2P Top Round Hole Plugin,P=2.54mm Female Headers ROHS; Manufacturer: XFCN; Item Type: Header; Manufacturer Part Number: MF254V-11-02-0743; LCSC Part Number: C2889984; Package: Plugin,P=2.54mm; ComponentLink1Description: LCSC; ComponentLink1URL: https://www.lcsc.com/product-detail/Female-Headers_XFCN-MF254V-11-02-0743_C2889984.html
J11 = WJ500V-5.08-3P: 1x3P 18A -40℃~+105℃ 250V Green 14~30 Straight pin 5.08mm 2.5 1 3 Plugin,P=5.08mm Screw terminal ROHS; Manufacturer: Ningbo Kangnex Elec; Item Type: Terminal Block; Manufacturer Part Number: WJ500V-5.08-3P; Package: Plugin,P=5.08mm; LCSC Part Number: C72334; ComponentLink1Description: LCSC; ComponentLink1URL: https://www.lcsc.com/product-detail/Screw-terminal_Ningbo-Kangnex-Elec-WJ500V-5-08-3P_C72334.html
J13-J16 = 1715721: TERM BLK 2P SIDE ENT 5.08MM PCB; Manufacturer: Phoenix Contact; Item Type: Terminal Blocks; Supplier: Digikey; Supplier Part Number: 277-1263-ND; Manufacturer Part Number: 1715721; RoHS: Yes; Stock: 13160; Pricing: 1=0.94 (USD); ComponentLink1URL: https://datasheet.ciiva.com/1120/1697161-1120393.pdf?src-supplier=Farnell; ComponentLink1Description: https://datasheet.ciiva.com/1120/1697161-1120393.pdf?src-supplier=Farnell; ComponentLink2URL: https://datasheet.ciiva.com/832/1715721-832095.pdf?src-supplier=Digikey; ComponentLink2Description: https://datasheet.ciiva.com/832/1715721-832095.pdf?src-supplier=Digikey; ComponentLink3URL: https://datasheet.ciiva.com/15169/getdatasheetpartid-212174-15169929.pdf?src-supplier=Verical; ComponentLink3Description: https://datasheet.ciiva.com/15169/getdatasheetpartid-212174-15169929.pdf?src-supplier=Verical; ComponentLink4URL: https://datasheet.ciiva.com/16046/1715721-16046034.pdf?src-supplier=Onlinecomponents.com; ComponentLink4Description: https://datasheet.ciiva.com/16046/1715721-16046034.pdf?src-supplier=Onlinecomponents.com
J18 = DBT50G-7.62-2P-BK-P: 1x2P Corner With Cover Plate 2 1 7.62mm -40℃~+105℃ 20A 300V Black 12~22 Straight Needle Plugin,P=7.62mm Barrier Terminal Blocks ROHS; Manufacturer: DORABO; Manufacturer Part Number: DBT50G-7.62-2P-BK-P; Package: Plugin,P=7.62mm; LCSC Part Number: C496127; Item Type: Terminal Block; ComponentLink1Description: LCSC; ComponentLink1URL: https://www.lcsc.com/product-detail/Barrier-Terminal-Blocks_DORABO-DBT50G-7-62-2P-BK-P_C496127.html
J19-J22 = DBT50G-7.62-8P-BK-P: 1x8P Corner With Cover Plate 8 1 7.62mm -40℃~+105℃ 20A 300V Black 12~22 Straight Needle Plugin,P=7.62mm Barrier Terminal Blocks ROHS; Manufacturer: DORABO; Manufacturer Part Number: DBT50G-7.62-8P-BK-P; Package: Plugin,P=7.62mm; LCSC Part Number: C918112; Item Type: Terminal Block; ComponentLink1Description: LCSC; ComponentLink1URL: https://www.lcsc.com/product-detail/Barrier-Terminal-Blocks_DORABO-DBT50G-7-62-8P-BK-P_C918112.html
J36-J51 = 0447690401: 4 Position Receptacle Connector 0.118" (3.00mm) Through Hole Tin; Manufacturer: Molex; Manufacturer Part Number: 0447690401; Digikey Part Number: 23-0447690401-ND; Item Type: Connector; Package: THT; ComponentLink1Description: Digikey; ComponentLink1URL: https://www.digikey.my/en/products/detail/molex/0447690401/513216?s=N4IgTCBcDaICxwOwDYCcAGO6CMIC6AvkA